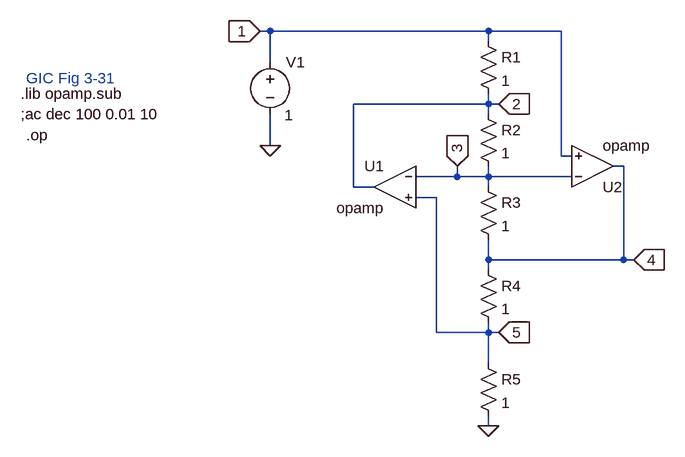
[diagram p0: schematic GIC circuit.asc]
GIC circuit.asc, the LTspice schematic file:
Version 4
SHEET 1 880 756
WIRE -288 128 -304 128
WIRE 48 128 -288 128
WIRE 160 128 48 128
WIRE 48 144 48 128
WIRE -288 176 -288 128
WIRE 48 240 48 224
WIRE 48 240 -160 240
WIRE 64 240 48 240
WIRE 48 256 48 240
WIRE -288 304 -288 256
WIRE 160 320 160 128
WIRE 176 320 160 320
WIRE 256 336 240 336
WIRE 0 352 0 336
WIRE 0 352 -64 352
WIRE 48 352 48 336
WIRE 48 352 0 352
WIRE 176 352 48 352
WIRE -160 368 -160 240
WIRE -128 368 -160 368
WIRE 48 368 48 352
WIRE -32 384 -64 384
WIRE 48 480 48 448
WIRE 256 480 256 336
WIRE 256 480 48 480
WIRE 272 480 256 480
WIRE 48 496 48 480
WIRE -32 592 -32 384
WIRE 48 592 48 576
WIRE 48 592 -32 592
WIRE 64 592 48 592
WIRE 48 640 48 592
WIRE 48 736 48 720
FLAG 48 736 0
FLAG -288 304 0
FLAG -304 128 1
IOPIN -304 128 In
FLAG 64 240 2
IOPIN 64 240 In
FLAG 0 336 3
IOPIN 0 336 In
FLAG 272 480 4
IOPIN 272 480 In
FLAG 64 592 5
IOPIN 64 592 In
SYMBOL OpAmps\\opamp 208 400 M180
SYMATTR InstName U2
SYMBOL voltage -288 160 R0
WINDOW 123 24 124 Left 2
WINDOW 39 0 0 Left 0
WINDOW 3 22 97 Left 2
SYMATTR InstName V1
SYMATTR Value 1
SYMBOL OpAmps\\opamp -96 304 M0
SYMATTR InstName U1
SYMBOL res 32 240 R0
SYMATTR InstName R2
SYMATTR Value 1
SYMBOL res 32 480 R0
SYMATTR InstName R4
SYMATTR Value 1
SYMBOL res 32 624 R0
SYMATTR InstName R5
SYMATTR Value 1
SYMBOL res 32 128 R0
SYMATTR InstName R1
SYMATTR Value 1
SYMBOL res 32 352 R0
SYMATTR InstName R3
SYMATTR Value 1
TEXT -672 224 Left 2 !.lib opamp.sub
TEXT -664 200 Left 2 ;GIC Fig 3-31
TEXT -672 256 Left 2 !;ac dec 100 0.01 10
TEXT -664 288 Left 2 !.op

The netlist it stands for:
* GIC circuit.asc
XU2 3 1 4 opamp Aol=100K GBW=10Meg  ; pins invin noninvin out
V1 1 0 1
XU1 3 5 2 opamp Aol=100K GBW=10Meg  ; pins invin noninvin out
R2 2 3 1
R4 4 5 1
R5 5 0 1
R1 1 2 1
R3 3 4 1
.lib opamp.sub
* GIC Fig 3-31
;ac dec 100 0.01 10
.op
.backanno
.end